# EAGLE design DriverMosfet (EAGLE 7.2.0)
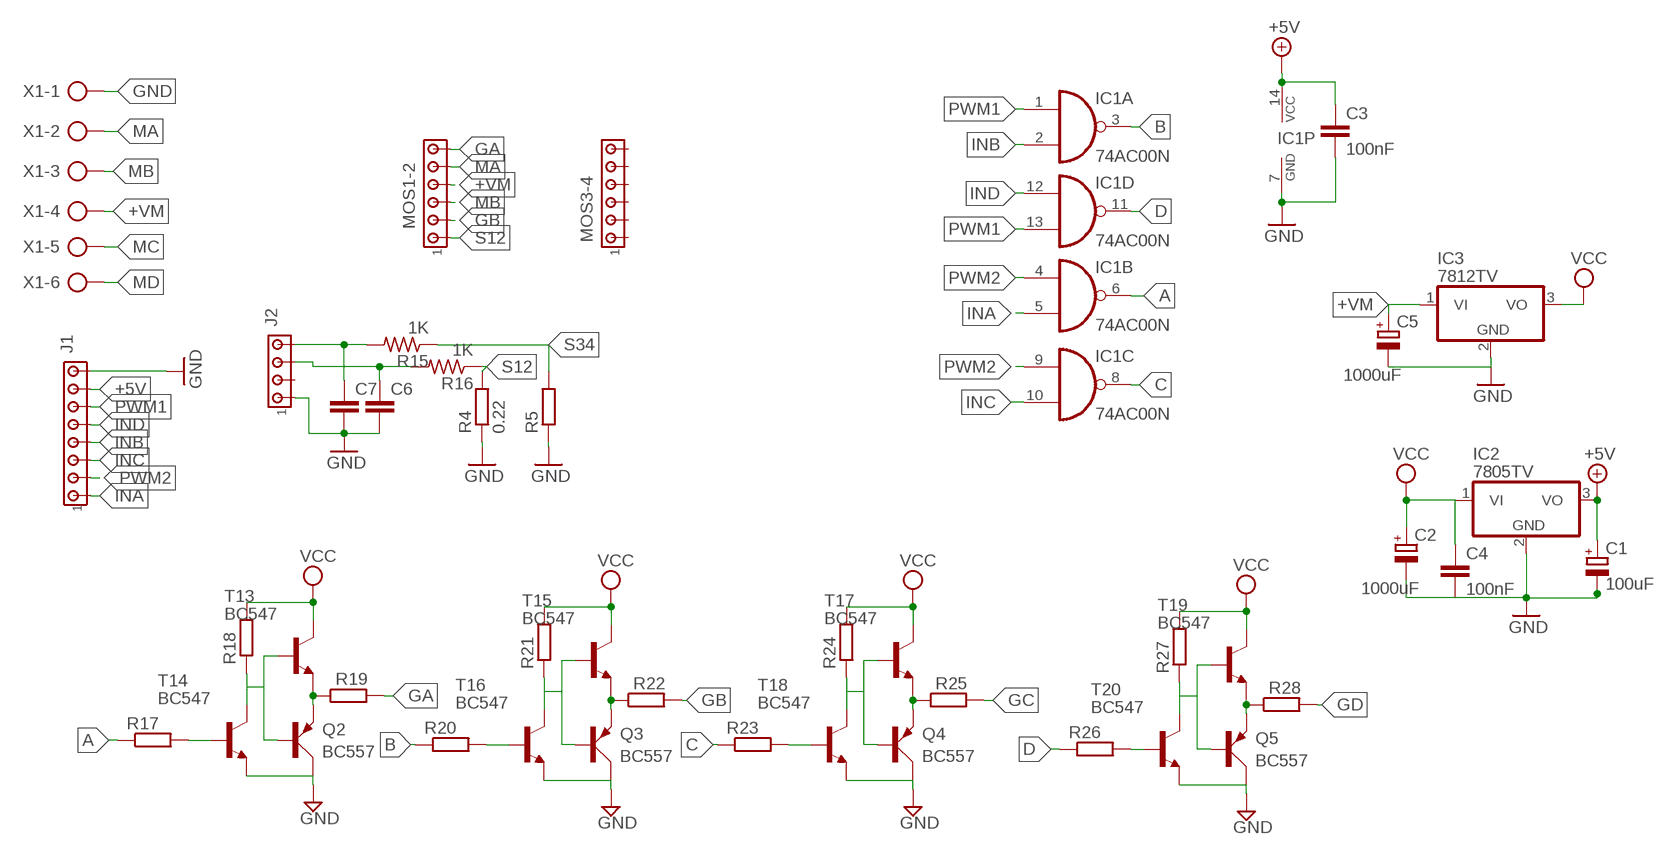
[diagram p0: schematic, sheet 1]

## Parts
C1  100uF  CPOL-EUE2.5-6  [E2,5-6]
C2  1000uF  CPOL-EUE3.5-8  [E3,5-8]
C3  100nF  C-EU050-025X075  [C050-025X075]
C4  100nF  C-EU050-025X075  [C050-025X075]
C5  1000uF  CPOL-EUE3.5-10  [E3,5-10]
C6  C-EU025-025X050  [C025-025X050]
C7  C-EU025-025X050  [C025-025X050]
IC1  74AC00N  [DIL14]
IC2  7805TV  [TO220V]
IC3  7812TV  [TO220V]
J1  MTA08-100  [10X08MTA]
J2  MTA04-100  [10X04MTA]
MOS1-2  MTA06-100  [10X06MTA]
MOS3-4  MTA06-100  [10X06MTA]
Q2  BC557  [SOT54A]
Q3  BC557  [SOT54A]
Q4  BC557  [SOT54A]
Q5  BC557  [SOT54A]
R4  0.22  R-EU_0411/12  [0411/12]
R5  R-EU_0411/12  [0411/12]
R15  1K  R-US_0207/7  [0207/7@1]
R16  1K  R-US_0207/7  [0207/7@1]
R17  R-EU_0207/7  [0207/7]
R18  R-EU_0207/7  [0207/7]
R19  R-EU_0207/7  [0207/7]
R20  R-EU_0207/7  [0207/7]
R21  R-EU_0207/7  [0207/7]
R22  R-EU_0207/7  [0207/7]
R23  R-EU_0207/7  [0207/7]
R24  R-EU_0207/7  [0207/7]
R25  R-EU_0207/7  [0207/7]
R26  R-EU_0207/7  [0207/7]
R27  R-EU_0207/7  [0207/7]
R28  R-EU_0207/7  [0207/7]
T13  BC547  [TO92]
T14  BC547  [TO92]
T15  BC547  [TO92]
T16  BC547  [TO92]
T17  BC547  [TO92]
T18  BC547  [TO92]
T19  BC547  [TO92]
T20  BC547  [TO92]
X1  AK500/6-H  [AK500/6-H]

## Nets
+5V: C1.+ C3.1 IC1.14(P:VCC) IC2.3(VO) J1.7
+VM: C5.+ IC3.1(VI) MOS1-2.4 X1.4
A: IC1.6(B:O) R17.1
B: IC1.3(A:O) R20.1
C: IC1.8(C:O) R23.1
D: IC1.11(D:O) R26.1
GA: MOS1-2.6 R19.2
GB: MOS1-2.2 R22.2
GC: R25.2
GD: R28.2
GND: C1.- C2.- C3.2 C4.2 C5.- C6.2 IC1.7(P:GND) IC2.2(GND) IC3.2(GND) J1.8 J2.1 Q2.C Q3.C Q4.C Q5.C R4.1 R5.1 T14.1(E) T16.1(E) T18.1(E) T20.1(E) X1.1
INA: IC1.5(B:I1) J1.1
INB: IC1.2(A:I1) J1.4
INC: IC1.10(C:I1) J1.3
IND: IC1.12(D:I0) J1.5
MA: MOS1-2.5 X1.2
MB: MOS1-2.3 X1.3
MC: X1.5
MD: X1.6
N$3: C7.1 J2.4 R15.2
N$4: R17.2 T14.2(B)
N$6: C6.1 J2.3 R16.2
N$7: Q3.E R22.1 T15.1(E)
N$8: Q2.E R19.1 T13.1(E)
N$9: Q4.E R25.1 T17.1(E)
N$12: Q2.B R18.1 T13.2(B) T14.3(C)
N$13: R23.2 T18.2(B)
N$14: Q4.B R24.1 T17.2(B) T18.3(C)
N$16: R20.2 T16.2(B)
N$17: Q3.B R21.1 T15.2(B) T16.3(C)
N$22: Q5.E R28.1 T19.1(E)
N$23: R26.2 T20.2(B)
N$24: Q5.B R27.1 T19.2(B) T20.3(C)
PWM1: IC1.1(A:I0) IC1.13(D:I1) J1.6
PWM2: IC1.4(B:I0) IC1.9(C:I0) J1.2
S12: MOS1-2.1 R4.2 R16.1
S34: R5.2 R15.1
VCC: C2.+ C4.1 IC2.1(VI) IC3.3(VO) R18.2 R21.2 R24.2 R27.2 T13.3(C) T15.3(C) T17.3(C) T19.3(C)
Unconnected: C7.2 J2.2 MOS3-4.1 MOS3-4.2 MOS3-4.3 MOS3-4.4 MOS3-4.5 MOS3-4.6

## Library data of the parts
C1 C2 C5 = rcl:CPOL-EU: POLARIZED CAPACITOR, European symbol
C3 C4 C6 C7 = rcl:C-EU: CAPACITOR, European symbol
IC1 = 74xx-eu:74*00: Quad 2-input NAND gate
IC2 IC3 = linear:78*: Positive VOLTAGE REGULATOR Source: http://cache.national.com/ds/LM/LM78L05.pdf http://www.fairchildsemi.com/ds/LM/LM7805.pdf
J1 = con-amp:MTA08-100: AMP connector
J2 = con-amp:MTA04-100: AMP connector
MOS1-2 MOS3-4 = con-amp:MTA06-100: AMP connector Connection corrected 2014-09-19
Q2-Q5 = transistor-small-signal:BC557: PNP TRANSISTOR
R4 R5 = resistor:R-EU_: RESISTOR, European symbol
R15 R16 = rcl:R-US_: RESISTOR, American symbol; SPICEPREFIX: R
R17-R28 = rcl:R-EU_: RESISTOR, European symbol
T13-T20 = transistor-neu-to92:BC547: NPN TRANSISTOR
X1 = con-ptr500:AK500/6-H: CONNECTOR Aug. 2004 / PTR Meßtechnik: Die Bezeichnung der Serie AK505 wurde geändert. Es handelt sich hierbei um AK500 in horizontaler Ausführung.

## Board
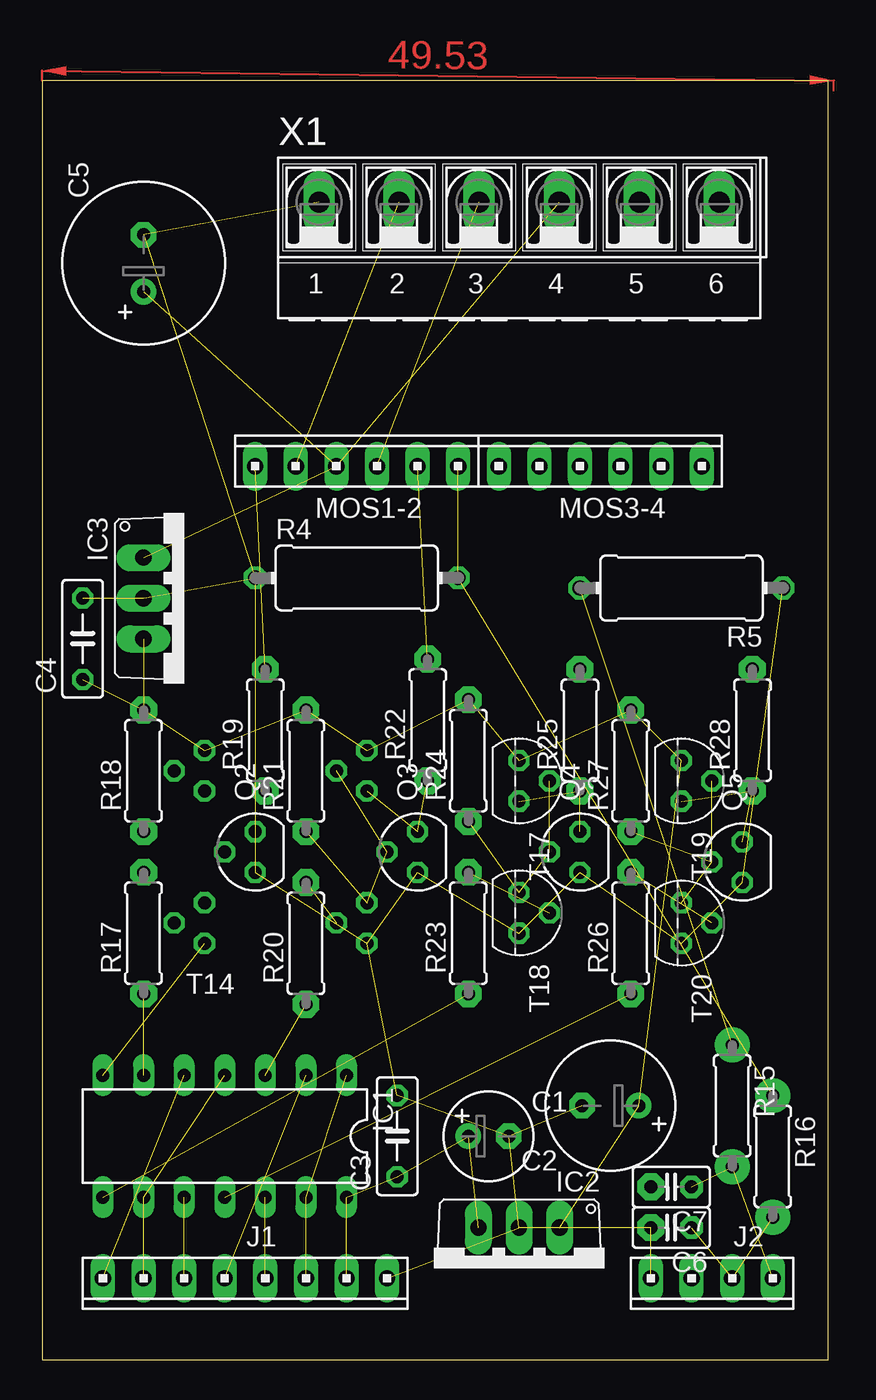
[diagram p1: board, top side]
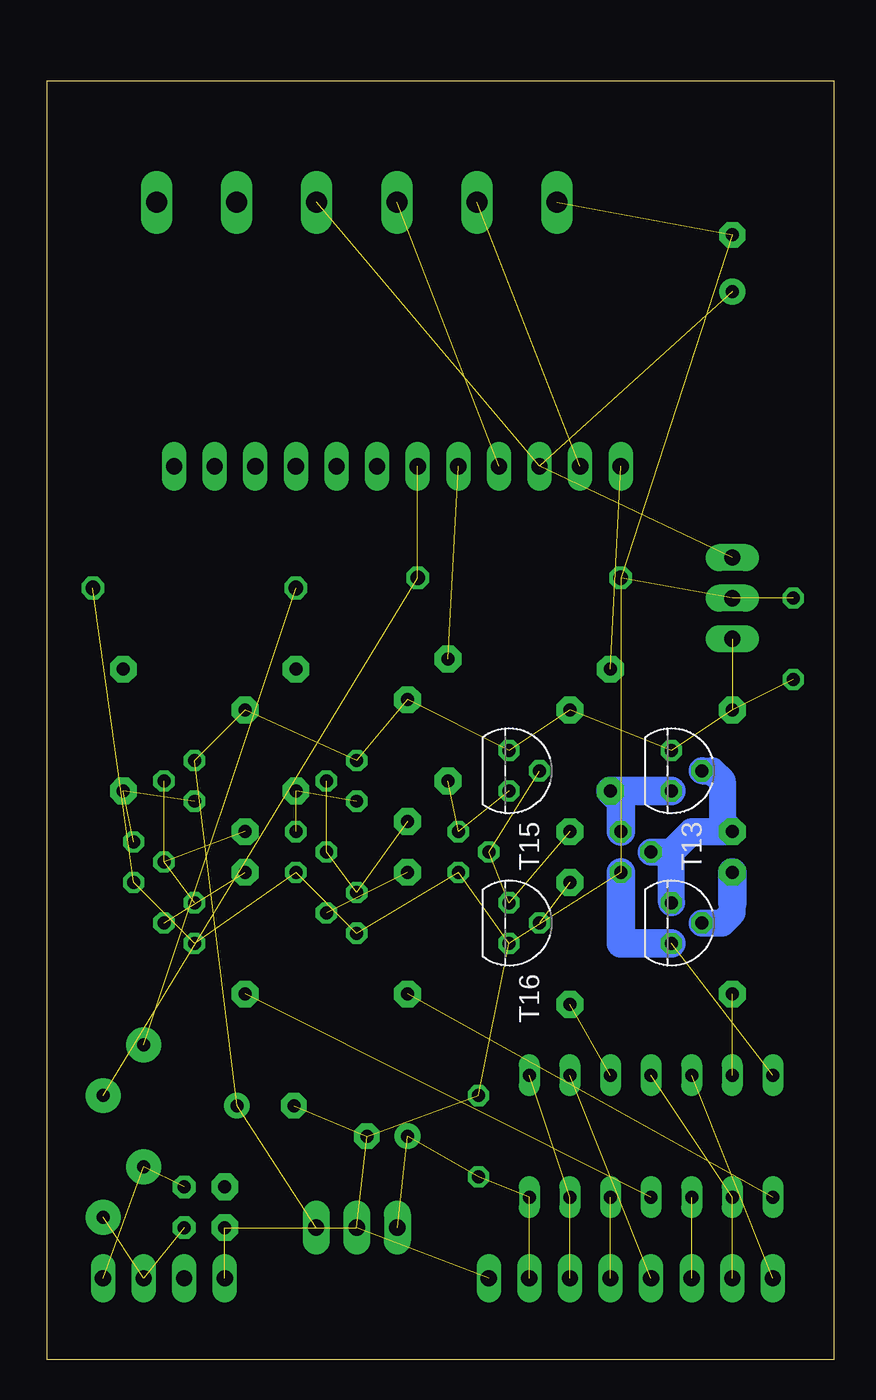
[diagram p2: board, bottom side, seen from below]

Size 49.2 x 80 mm. Coordinates in mm from the lower left corner, seen from the top.
Outline: 0,0 49.2,0 49.2,80 0,80 0,0
Copper layers (1*16): Top 0.035mm / dielectric 1.5mm / Bottom 0.035mm
Design rules "default": minimum track width 10mil, minimum drill 24mil, track to track 8mil, track to pad 8mil, pad to pad 8mil, via to via 8mil, smd to smd 8mil, copper to edge 40mil, drill to drill 8mil, minimum pad ring 10mil, minimum via ring 8mil, stop-mask expansion 4mil, vias tented up to drill 0mil, thermal gap 10mil

### Footprints (pad centres in the part's own frame; a part is rotated, then mirrored left to right if it is on the bottom)
E2,5-6 = drill 0.813 pad 1.6: + -1.27,0 | drill 0.813 pad 1.6 octagon: - 1.27,0
E3,5-8 = drill 0.813 pad 1.6: + -1.778,0 | drill 0.813 pad 1.6 octagon: - 1.778,0
C050-025X075 = drill 0.813 octagon: 1 -2.54,0; 2 2.54,0
E3,5-10 = drill 0.813 pad 1.6: + -1.778,0 | drill 0.813 pad 1.6 octagon: - 1.778,0
C025-025X050 = drill 0.813 pad 1.422 octagon: 1 -1.27,0 | drill 0.813 pad 1.676 octagon: 2 1.27,0
DIL14 = drill 0.813 long: 1 -7.62,-3.81; 2 -5.08,-3.81; 3 -2.54,-3.81; 4 0,-3.81; 5 2.54,-3.81; 6 5.08,-3.81; 7 7.62,-3.81; 8 7.62,3.81; 9 5.08,3.81; 10 2.54,3.81; 11 0,3.81; 12 -2.54,3.81; 13 -5.08,3.81; 14 -7.62,3.81
TO220V = drill 1.016 pad 1.676 long: 1 -2.54,-2.54; 2 0,-2.54; 3 2.54,-2.54
10X08MTA = drill 1.016 long: 1 8.89,0; 2 6.35,0; 3 3.81,0; 4 1.27,0; 5 -1.27,0; 6 -3.81,0; 7 -6.35,0; 8 -8.89,0
10X04MTA = drill 1.016 long: 1 3.81,0; 2 1.27,0; 3 -1.27,0; 4 -3.81,0
10X06MTA = drill 1.016 long: 1 6.35,0; 2 3.81,0; 3 1.27,0; 4 -1.27,0; 5 -3.81,0; 6 -6.35,0
SOT54A = drill 0.813 octagon: B 0,1.905; C -1.27,0; E 1.27,0
0411/12 = drill 0.914 octagon: 1 -6.35,0; 2 6.35,0
0207/7@1 = drill 0.813 pad 2.184: 1 -3.81,0; 2 3.81,0
0207/7 = drill 0.813 pad 1.676 octagon: 1 -3.81,0; 2 3.81,0
TO92 = drill 0.813 octagon: 1 1.27,0; 2 0,1.905; 3 -1.27,0
AK500/6-H = drill 1.321 long: 1 -12.522,0; 2 -7.518,0; 3 -2.515,0; 4 2.515,0; 5 7.518,0; 6 12.522,0

### Placement (x,y rotation side)
C1  27.94,13.97 0 top
C2  35.56,15.88 180 top
C3  22.23,13.97 90 top
C4  2.54,45.09 90 top
C5  6.35,68.58 90 top
C6  39.37,8.26 180 top
C7  39.37,10.79 180 top
IC1  11.43,13.97 180 top
IC2  29.84,5.71 180 top
IC3  8.89,47.62 270 top
J1  12.7,5.08 180 top
J2  41.91,5.08 180 top
MOS1-2  19.68,55.88 0 top
MOS3-4  34.92,55.88 0 top
Q2  13.34,31.75 90 top
Q3  23.49,31.75 90 top
Q4  33.66,31.75 90 top
Q5  43.81,31.11 90 top
R4  19.68,48.9 0 top
R5  40.01,48.26 180 top
R15  43.18,15.88 270 top
R16  45.72,12.7 270 top
R17  6.35,26.67 90 top
R18  6.35,36.83 90 top
R19  13.97,39.37 90 top
R20  16.51,26.04 90 top
R21  16.51,36.83 90 top
R22  24.13,40.01 90 top
R23  26.67,26.67 90 top
R24  26.67,37.47 90 top
R25  33.66,39.37 90 top
R26  36.83,26.67 90 top
R27  36.83,36.83 90 top
R28  44.45,39.37 90 top
T13  10.16,36.83 270 bottom
T14  10.16,27.3 270 bottom
T15  20.32,36.83 270 bottom
T16  20.32,27.3 270 bottom
T17  29.84,36.2 270 top
T18  29.84,27.94 270 top
T19  40.01,36.2 270 top
T20  40.01,27.3 270 top
X1  29.84,72.39 0 top

### Tracks (layer width: path | path; a pad name or v marks a point on that pad's centre or on a via)
+5V  (4 unrouted)
+VM  (3 unrouted)
A  (1 unrouted)
B  (1 unrouted)
C  (1 unrouted)
D  (1 unrouted)
GA  (1 unrouted)
GB  (1 unrouted)
GND  (20 unrouted)
  Bottom 1.778: T14.1 13.34,26.04 Q2.C
INA  (1 unrouted)
INB  (1 unrouted)
INC  (1 unrouted)
IND  (1 unrouted)
MA  (1 unrouted)
MB  (1 unrouted)
N$3  (2 unrouted)
N$4
  Bottom 1.676: T14.2 6.98,27.3 6.35,27.94 6.35,28.57
  Bottom 1.778: 6.35,28.57 R17.2
N$6  (2 unrouted)
N$7  (2 unrouted)
N$8
  Bottom 1.778: Q2.E 13.34,34.92 R19.1 T13.1
N$9  (2 unrouted)
N$12
  Bottom 1.676: Q2.B 10.16,31.75 | 10.16,31.75 8.89,33.02 R18.1 6.98,33.66 6.98,36.2 7.62,36.83 T13.2 | T14.3 10.16,31.75
N$13  (1 unrouted)
N$14  (3 unrouted)
N$16  (1 unrouted)
N$17  (3 unrouted)
N$22  (2 unrouted)
N$23  (1 unrouted)
N$24  (3 unrouted)
PWM1  (2 unrouted)
PWM2  (2 unrouted)
S12  (2 unrouted)
S34  (1 unrouted)
VCC  (11 unrouted)
(copper drawn outside any net)
  shapes: Top area x1